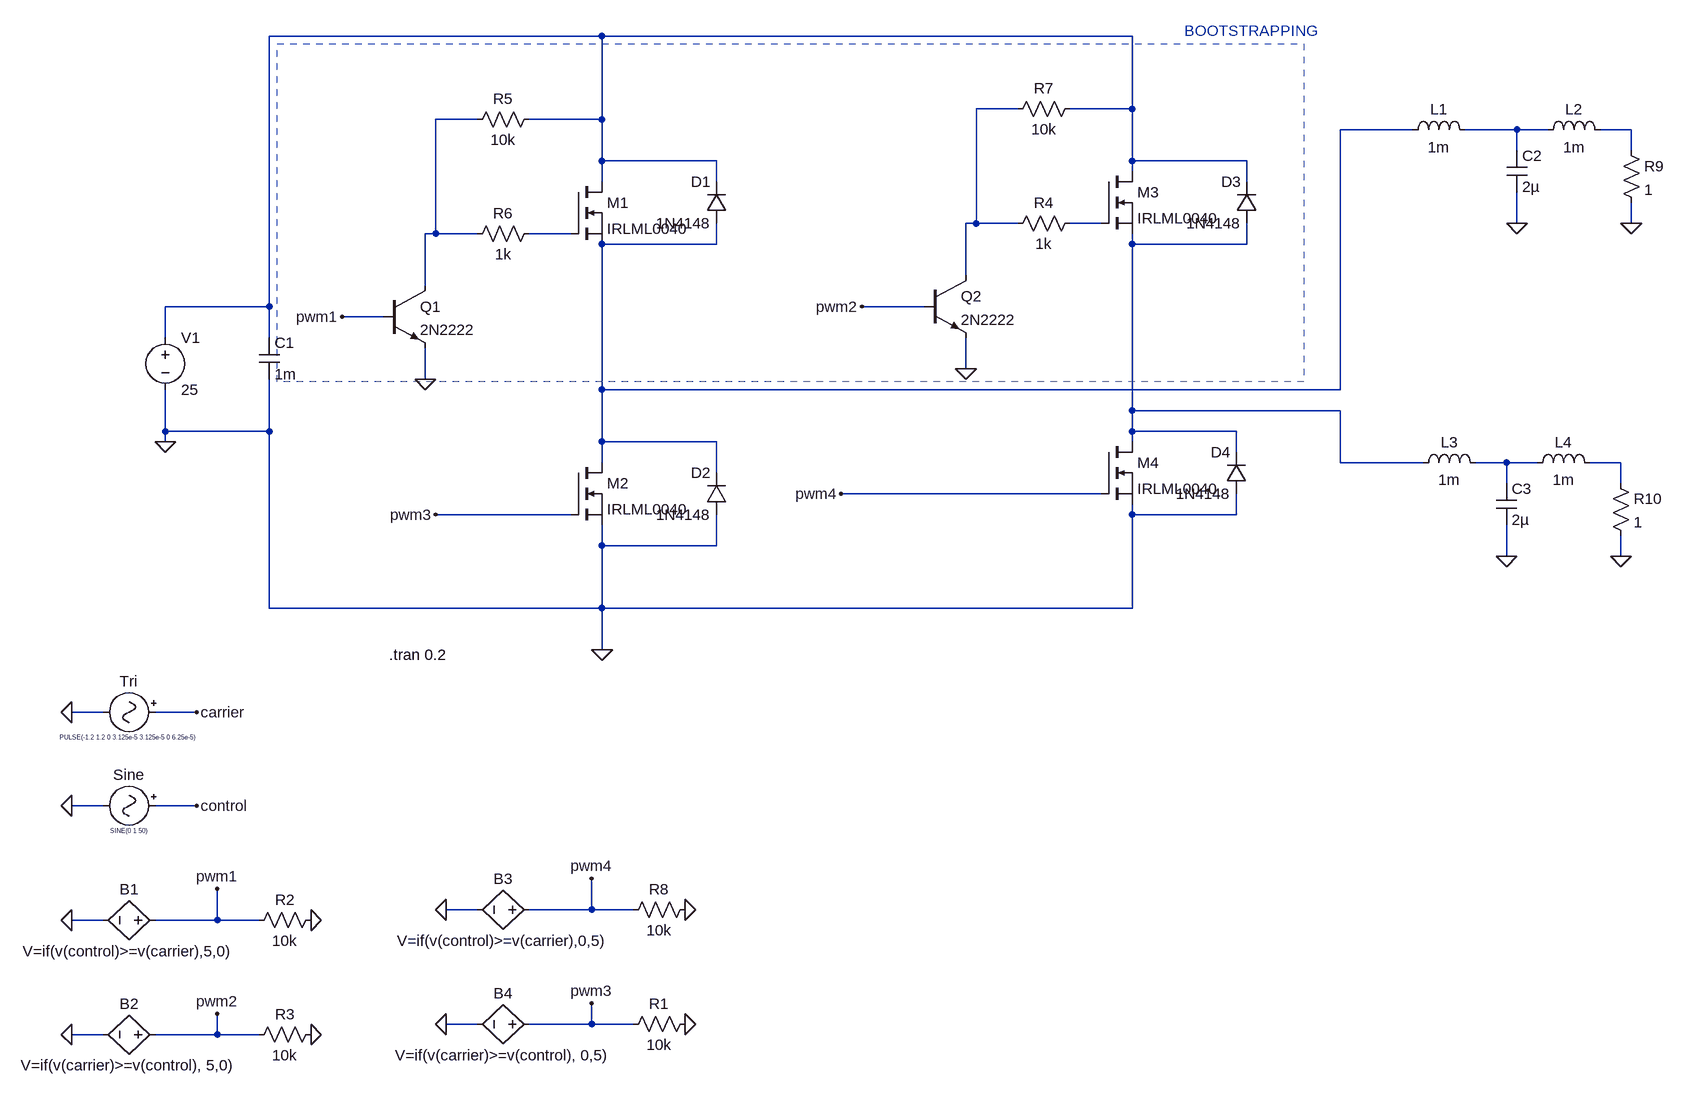
[diagram p0: schematic dcdc_fullbridge.asc]
dcdc_fullbridge.asc, the LTspice schematic file:
Version 4
SHEET 1 2916 1384
WIRE -208 -208 -720 -208
WIRE 608 -208 -208 -208
WIRE 432 -96 368 -96
WIRE 608 -96 608 -208
WIRE 608 -96 512 -96
WIRE -400 -80 -464 -80
WIRE -208 -80 -208 -208
WIRE -208 -80 -320 -80
WIRE 1040 -64 928 -64
WIRE 1200 -64 1120 -64
WIRE 1248 -64 1200 -64
WIRE 1376 -64 1328 -64
WIRE 1200 -32 1200 -64
WIRE 1376 -32 1376 -64
WIRE -208 -16 -208 -80
WIRE -32 -16 -208 -16
WIRE 608 -16 608 -96
WIRE 784 -16 608 -16
WIRE 608 0 608 -16
WIRE -208 16 -208 -16
WIRE -32 16 -32 -16
WIRE 784 16 784 -16
WIRE 368 80 368 -96
WIRE 368 80 352 80
WIRE 432 80 368 80
WIRE 560 80 512 80
WIRE 1200 80 1200 32
WIRE 1376 80 1376 48
WIRE -464 96 -464 -80
WIRE -464 96 -480 96
WIRE -400 96 -464 96
WIRE -256 96 -320 96
WIRE -32 112 -32 80
WIRE -32 112 -208 112
WIRE 608 112 608 96
WIRE 784 112 784 80
WIRE 784 112 608 112
WIRE 352 160 352 80
WIRE -480 176 -480 96
WIRE -720 208 -720 -208
WIRE -720 208 -880 208
WIRE 288 208 192 208
WIRE -544 224 -608 224
WIRE -880 256 -880 208
WIRE -720 256 -720 208
WIRE 352 304 352 256
WIRE -480 320 -480 272
WIRE -208 336 -208 112
WIRE 928 336 928 -64
WIRE 928 336 -208 336
WIRE 608 368 608 112
WIRE 928 368 608 368
WIRE -880 400 -880 336
WIRE -720 400 -720 320
WIRE -720 400 -880 400
WIRE 608 400 608 368
WIRE 768 400 608 400
WIRE -880 416 -880 400
WIRE -208 416 -208 336
WIRE -32 416 -208 416
WIRE 608 416 608 400
WIRE 768 432 768 400
WIRE -208 448 -208 416
WIRE 928 448 928 368
WIRE 1056 448 928 448
WIRE 1184 448 1136 448
WIRE 1232 448 1184 448
WIRE 1360 448 1312 448
WIRE -32 464 -32 416
WIRE 1184 480 1184 448
WIRE 1360 480 1360 448
WIRE 560 496 160 496
WIRE -256 528 -464 528
WIRE 608 528 608 512
WIRE 768 528 768 496
WIRE 768 528 608 528
WIRE -208 576 -208 544
WIRE -32 576 -32 528
WIRE -32 576 -208 576
WIRE 1184 592 1184 544
WIRE 1360 592 1360 560
WIRE -720 672 -720 400
WIRE -208 672 -208 576
WIRE -208 672 -720 672
WIRE 608 672 608 528
WIRE 608 672 -208 672
WIRE -208 736 -208 672
WIRE -976 832 -1024 832
WIRE -832 832 -896 832
WIRE -976 976 -1024 976
WIRE -832 976 -896 976
WIRE -400 1136 -448 1136
WIRE -224 1136 -224 1088
WIRE -224 1136 -320 1136
WIRE -160 1136 -224 1136
WIRE -976 1152 -1024 1152
WIRE -800 1152 -800 1104
WIRE -800 1152 -896 1152
WIRE -736 1152 -800 1152
WIRE -400 1312 -448 1312
WIRE -224 1312 -224 1280
WIRE -224 1312 -320 1312
WIRE -160 1312 -224 1312
WIRE -976 1328 -1024 1328
WIRE -800 1328 -800 1296
WIRE -800 1328 -896 1328
WIRE -736 1328 -800 1328
FLAG -880 416 0
FLAG -1024 832 0
FLAG -1024 976 0
FLAG -832 832 carrier
FLAG -832 976 control
FLAG -608 224 pwm1
FLAG 160 496 pwm4
FLAG 192 208 pwm2
FLAG -464 528 pwm3
FLAG -1024 1152 0
FLAG -1024 1328 0
FLAG -656 1152 0
FLAG -656 1328 0
FLAG -800 1104 pwm1
FLAG -800 1296 pwm2
FLAG -480 320 0
FLAG 352 304 0
FLAG -208 736 0
FLAG -448 1136 0
FLAG -80 1136 0
FLAG -224 1088 pwm4
FLAG -448 1312 0
FLAG -80 1312 0
FLAG -224 1280 pwm3
FLAG 1200 80 0
FLAG 1376 80 0
FLAG 1184 592 0
FLAG 1360 592 0
SYMBOL voltage -880 240 R0
SYMATTR InstName V1
SYMATTR Value 25
SYMATTR SpiceLine Rser=0.
SYMBOL cap -736 256 R0
SYMATTR InstName C1
SYMATTR Value 1m
SYMATTR SpiceLine Rser=34m Lser=0 mfg="Chemi-Con" pn="LXF25VB102M12X25LL" type="Al electrolytic"
SYMBOL signal -880 832 R90
WINDOW 0 -32 56 VBottom 2
WINDOW 3 32 56 VTop 0
SYMATTR InstName Tri
SYMATTR Value PULSE(-1.2 1.2 0 3.125e-5 3.125e-5 0 6.25e-5)
SYMBOL signal -880 976 R90
WINDOW 0 -32 56 VBottom 2
WINDOW 3 32 56 VTop 0
SYMATTR InstName Sine
SYMATTR Value SINE(0 1 50)
SYMBOL bv -880 1152 R90
WINDOW 0 -32 56 VBottom 2
WINDOW 3 32 56 VTop 2
SYMATTR InstName B1
SYMATTR Value V=if(v(control)>=v(carrier),5,0)
SYMBOL bv -880 1328 R90
WINDOW 0 -32 56 VBottom 2
WINDOW 3 32 56 VTop 2
SYMATTR InstName B2
SYMATTR Value V=if(v(carrier)>=v(control), 5,0)
SYMBOL Res -640 1136 R90
WINDOW 0 0 56 VBottom 2
WINDOW 3 32 56 VTop 2
SYMATTR InstName R2
SYMATTR Value 10k
SYMBOL Res -640 1312 R90
WINDOW 0 0 56 VBottom 2
WINDOW 3 32 56 VTop 2
SYMATTR InstName R3
SYMATTR Value 10k
SYMBOL nmos -256 16 R0
SYMATTR InstName M1
SYMATTR Value IRLML0040
SYMBOL nmos -256 448 R0
SYMATTR InstName M2
SYMATTR Value IRLML0040
SYMBOL nmos 560 0 R0
SYMATTR InstName M3
SYMATTR Value IRLML0040
SYMBOL nmos 560 416 R0
SYMATTR InstName M4
SYMATTR Value IRLML0040
SYMBOL diode -16 80 R180
WINDOW 0 24 64 Left 2
WINDOW 3 24 0 Left 2
SYMATTR InstName D1
SYMATTR Value 1N4148
SYMBOL diode -16 528 R180
WINDOW 0 24 64 Left 2
WINDOW 3 24 0 Left 2
SYMATTR InstName D2
SYMATTR Value 1N4148
SYMBOL diode 800 80 R180
WINDOW 0 24 64 Left 2
WINDOW 3 24 0 Left 2
SYMATTR InstName D3
SYMATTR Value 1N4148
SYMBOL diode 784 496 R180
WINDOW 0 24 64 Left 2
WINDOW 3 24 0 Left 2
SYMATTR InstName D4
SYMATTR Value 1N4148
SYMBOL npn -544 176 R0
SYMATTR InstName Q1
SYMATTR Value 2N2222
SYMBOL Res -304 80 R90
WINDOW 0 0 56 VBottom 2
WINDOW 3 32 56 VTop 2
SYMATTR InstName R6
SYMATTR Value 1k
SYMBOL Res -304 -96 R90
WINDOW 0 0 56 VBottom 2
WINDOW 3 32 56 VTop 2
SYMATTR InstName R5
SYMATTR Value 10k
SYMBOL npn 288 160 R0
SYMATTR InstName Q2
SYMATTR Value 2N2222
SYMBOL Res 528 64 R90
WINDOW 0 0 56 VBottom 2
WINDOW 3 32 56 VTop 2
SYMATTR InstName R4
SYMATTR Value 1k
SYMBOL Res 528 -112 R90
WINDOW 0 0 56 VBottom 2
WINDOW 3 32 56 VTop 2
SYMATTR InstName R7
SYMATTR Value 10k
SYMBOL bv -304 1136 R90
WINDOW 0 -32 56 VBottom 2
WINDOW 3 32 56 VTop 2
SYMATTR InstName B3
SYMATTR Value V=if(v(control)>=v(carrier),0,5)
SYMBOL Res -64 1120 R90
WINDOW 0 0 56 VBottom 2
WINDOW 3 32 56 VTop 2
SYMATTR InstName R8
SYMATTR Value 10k
SYMBOL bv -304 1312 R90
WINDOW 0 -32 56 VBottom 2
WINDOW 3 32 56 VTop 2
SYMATTR InstName B4
SYMATTR Value V=if(v(carrier)>=v(control), 0,5)
SYMBOL Res -64 1296 R90
WINDOW 0 0 56 VBottom 2
WINDOW 3 32 56 VTop 2
SYMATTR InstName R1
SYMATTR Value 10k
SYMBOL Cap 1184 -32 R0
SYMATTR InstName C2
SYMATTR Value 2µ
SYMBOL ind 1040 464 R270
WINDOW 0 32 56 VTop 2
WINDOW 3 5 56 VBottom 2
SYMATTR InstName L3
SYMATTR Value 1m
SYMBOL Cap 1168 480 R0
SYMATTR InstName C3
SYMATTR Value 2µ
SYMBOL ind 1216 464 R270
WINDOW 0 32 56 VTop 2
WINDOW 3 5 56 VBottom 2
SYMATTR InstName L4
SYMATTR Value 1m
SYMBOL Res 1344 464 R0
SYMATTR InstName R10
SYMATTR Value 1
SYMBOL ind 1024 -48 R270
WINDOW 0 32 56 VTop 2
WINDOW 3 5 56 VBottom 2
SYMATTR InstName L1
SYMATTR Value 1m
SYMBOL ind 1232 -48 R270
WINDOW 0 32 56 VTop 2
WINDOW 3 5 56 VBottom 2
SYMATTR InstName L2
SYMATTR Value 1m
SYMBOL Res 1360 -48 R0
SYMATTR InstName R9
SYMATTR Value 1
TEXT -536 744 Left 2 !.tran 0.2
TEXT 688 -216 Left 2 ;BOOTSTRAPPING
RECTANGLE Normal -708 -196 872 324 2

The netlist it stands for:
* dcdc_fullbridge.asc
V1 N001 0 25 Rser=0.
C1 N001 0 1m Rser=34m Lser=0 mfg="Chemi-Con" pn="LXF25VB102M12X25LL" type="Al electrolytic"
V§Tri carrier 0 PULSE(-1.2 1.2 0 3.125e-5 3.125e-5 0 6.25e-5)
V§Sine control 0 SINE(0 1 50)
B1 pwm1 0 V=if(v(control)>=v(carrier),5,0)
B2 pwm2 0 V=if(v(carrier)>=v(control), 5,0)
R2 0 pwm1 10k
R3 0 pwm2 10k
M1 N001 N008 N004 N004 IRLML0040
M2 N004 pwm3 0 0 IRLML0040
M3 N001 N007 N009 N009 IRLML0040
M4 N009 pwm4 0 0 IRLML0040
D1 N004 N001 1N4148
D2 0 N004 1N4148
D3 N009 N001 1N4148
D4 0 N009 1N4148
Q1 N003 pwm1 0 0 2N2222
R6 N008 N003 1k
R5 N001 N003 10k
Q2 N002 pwm2 0 0 2N2222
R4 N007 N002 1k
R7 N001 N002 10k
B3 pwm4 0 V=if(v(control)>=v(carrier),0,5)
R8 0 pwm4 10k
B4 pwm3 0 V=if(v(carrier)>=v(control), 0,5)
R1 0 pwm3 10k
C2 N005 0 2µ
L3 N009 N010 1m
C3 N010 0 2µ
L4 N010 N011 1m
R10 N011 0 1
L1 N004 N005 1m
L2 N005 N006 1m
R9 N006 0 1
.model D D
.lib standard.dio
.model NPN NPN
.model PNP PNP
.lib standard.bjt
.model NMOS NMOS
.model PMOS PMOS
.lib standard.mos
.tran 0.2
* BOOTSTRAPPING
.backanno
.end